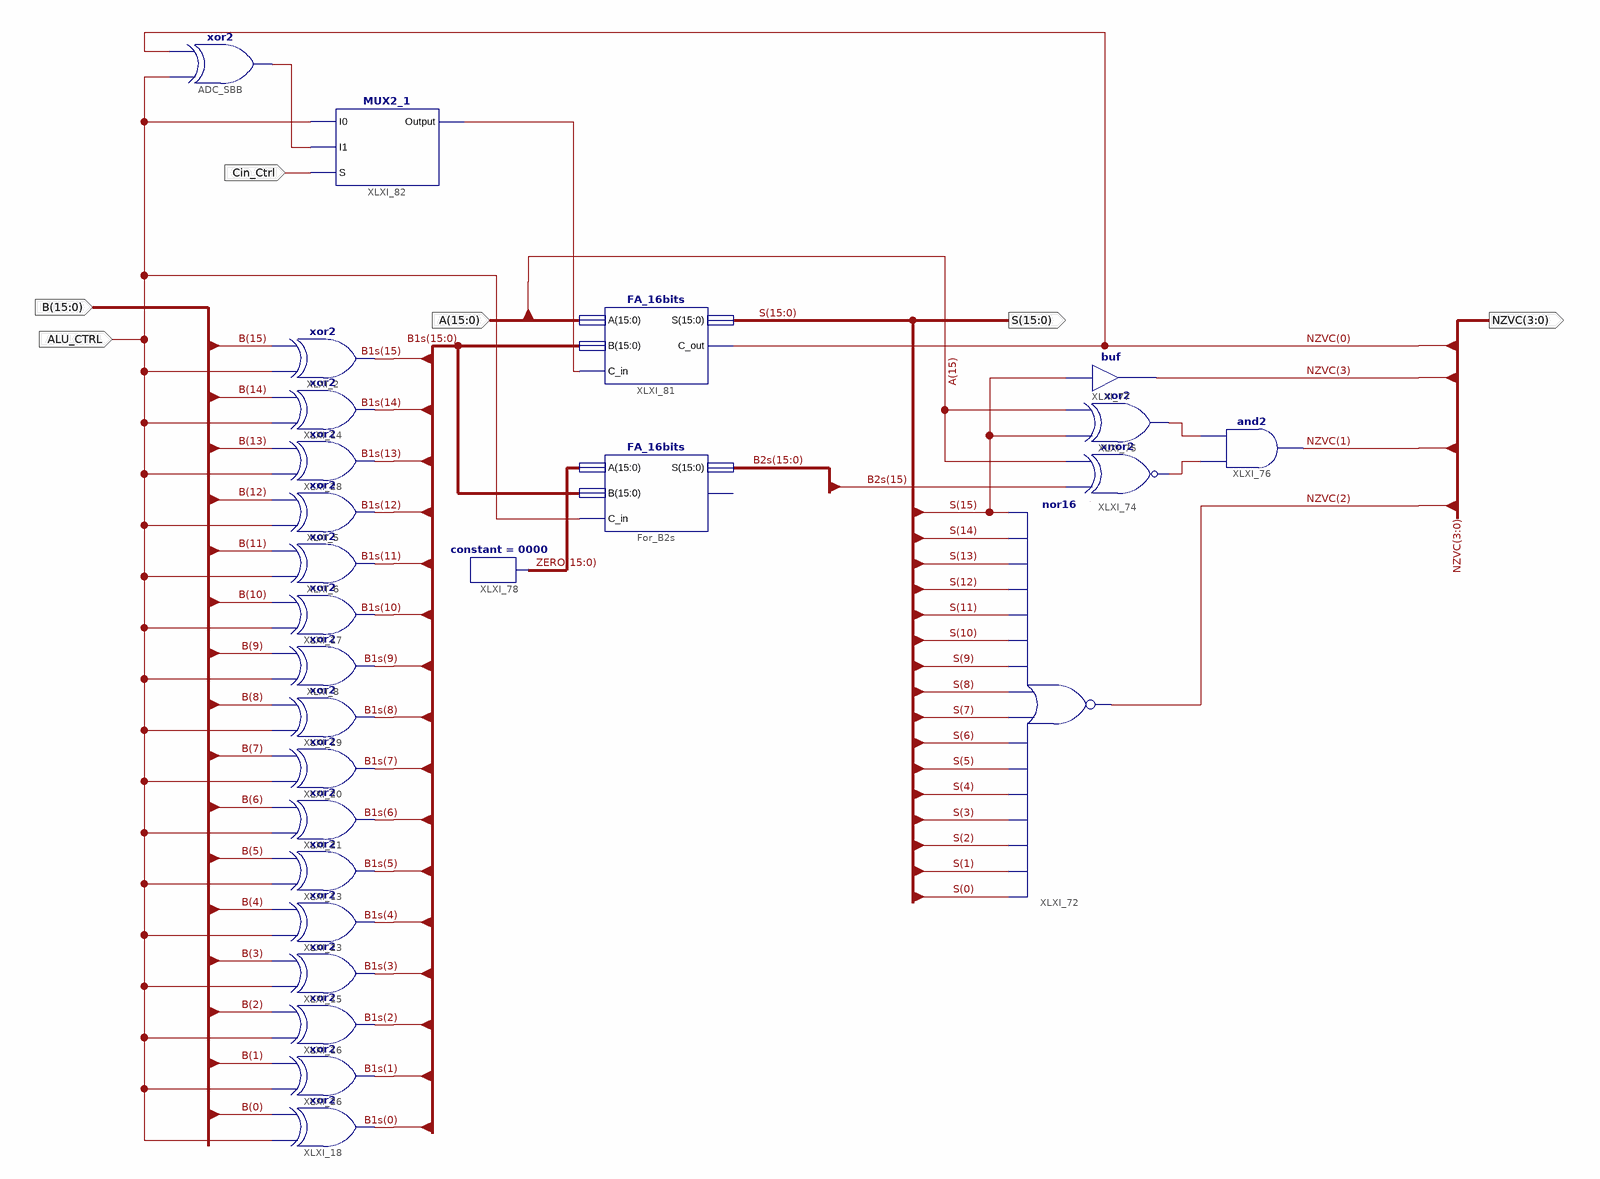
[diagram p0: schematic sheet 1]
// Xilinx ISE schematic ALU_16bits.sch (virtex6) as structural Verilog: 26 symbols, 6 ports
module ALU_16bits (
  input  [15:0] A,
  input  [15:0] B,
  input  ALU_CTRL,
  input  Cin_Ctrl,
  output [15:0] S,
  output [3:0] NZVC
);

  wire XLXN_196, XLXN_197, XLXN_204, XLXN_207;
  wire [15:0] B1s, B2s, ZERO;

  xor XLXI_28 (B1s[13], ALU_CTRL, B[13]);
  xor XLXI_18 (B1s[0], ALU_CTRL, B[0]);
  xor XLXI_26 (B1s[1], ALU_CTRL, B[1]);
  xor XLXI_16 (B1s[2], ALU_CTRL, B[2]);
  xor XLXI_15 (B1s[3], ALU_CTRL, B[3]);
  xor XLXI_23 (B1s[4], ALU_CTRL, B[4]);
  xor XLXI_13 (B1s[5], ALU_CTRL, B[5]);
  xor XLXI_21 (B1s[6], ALU_CTRL, B[6]);
  xor XLXI_20 (B1s[7], ALU_CTRL, B[7]);
  xor XLXI_19 (B1s[8], ALU_CTRL, B[8]);
  xor XLXI_8 (B1s[9], ALU_CTRL, B[9]);
  xor XLXI_17 (B1s[10], ALU_CTRL, B[10]);
  xor XLXI_6 (B1s[11], ALU_CTRL, B[11]);
  xor XLXI_5 (B1s[12], ALU_CTRL, B[12]);
  xor XLXI_14 (B1s[14], ALU_CTRL, B[14]);
  xor XLXI_2 (B1s[15], ALU_CTRL, B[15]);
  FA_16bits For_B2s (.A(ZERO), .B(B1s), .C_in(ALU_CTRL), .S(B2s));  // open: C_out
  nor XLXI_72 (NZVC[2], S[0], S[1], S[2], S[3], S[4], S[5], S[6], S[7], S[8], S[9], S[10], S[11], S[12], S[13], S[14], S[15]);
  xnor XLXI_74 (XLXN_197, B2s[15], A[15]);
  xor XLXI_75 (XLXN_196, S[15], A[15]);
  and XLXI_76 (NZVC[1], XLXN_197, XLXN_196);
  buf XLXI_77 (NZVC[3], S[15]);
  constant #(.CValue("0000")) XLXI_78 (.O(ZERO));
  FA_16bits XLXI_81 (.A(A), .B(B1s), .C_in(XLXN_204), .C_out(NZVC[0]), .S(S));
  MUX2_1 XLXI_82 (.I0(ALU_CTRL), .I1(XLXN_207), .Output(XLXN_204), .S(Cin_Ctrl));
  xor ADC_SBB (XLXN_207, ALU_CTRL, NZVC[0]);
endmodule
